# Altium project SensorFusion_V1.2.PrjPcb
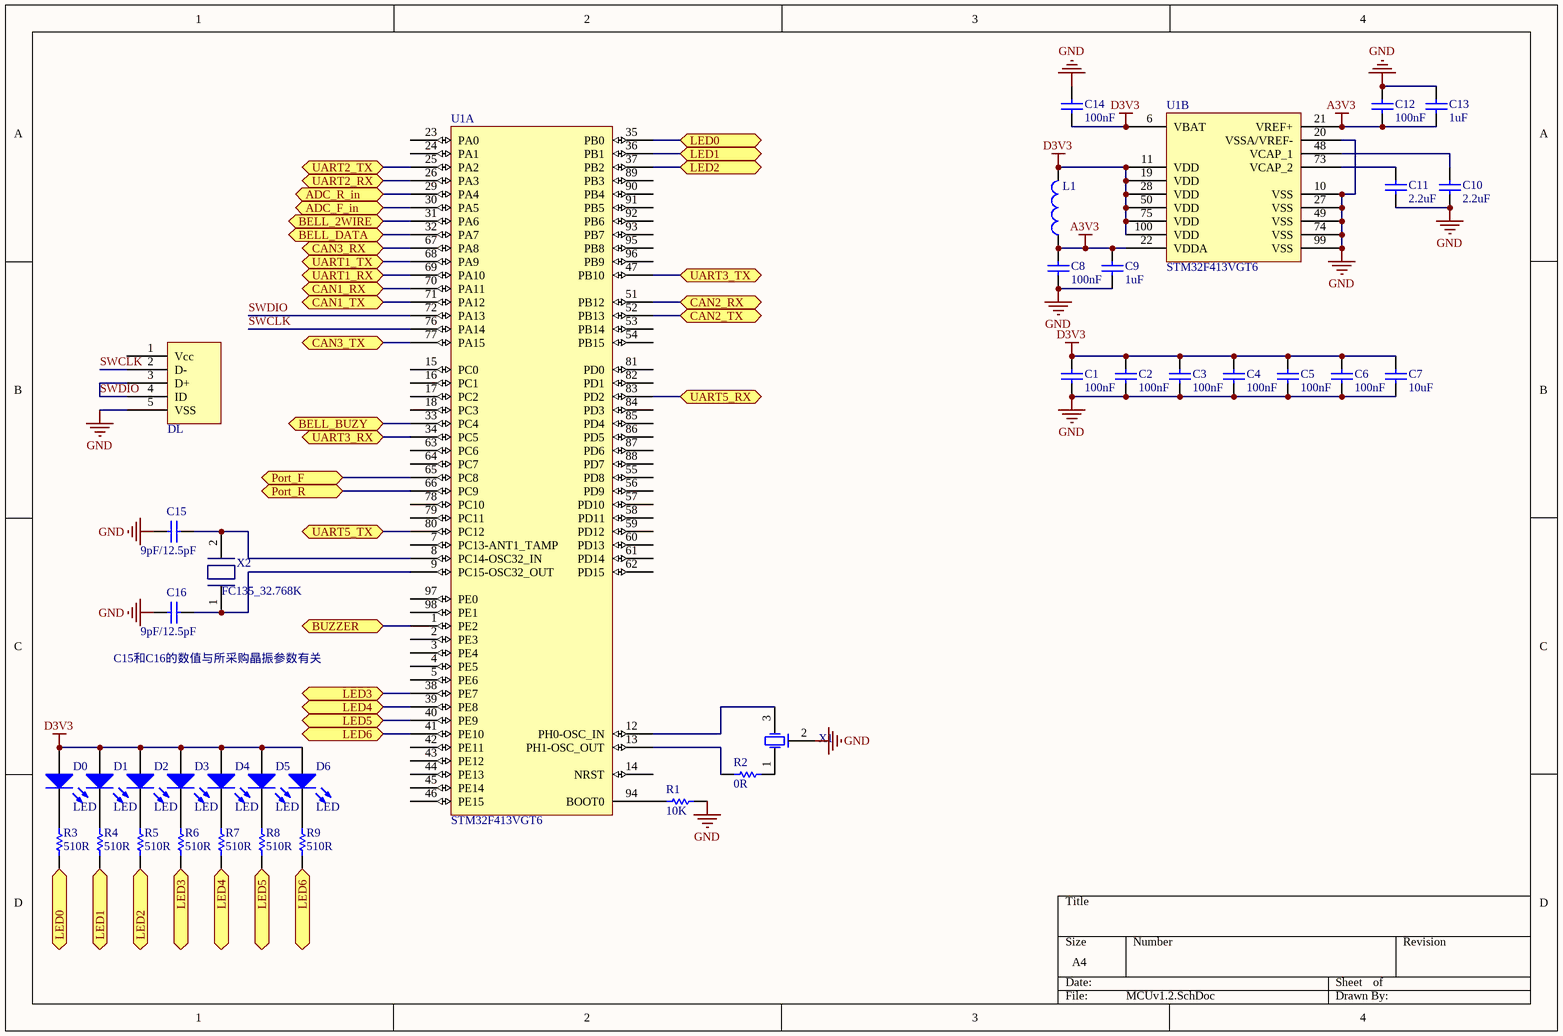
[diagram p0: MCUv1.2.SchDoc]
4 sheets, 137 parts. Net scope: flat (ports and power ports of the same name join across sheets).
Board file: SensorFusionV1.2.PcbDoc
Sheets:
  MCUv1.2.SchDoc
  InterfaceV1.2.SchDoc
  PowerV1.2.SchDoc
  AEBS component_FrontV1.2.SchDoc

## Sheet MCUv1.2.SchDoc
size A4

### Parts
C1  100nF  [0402]
C2  100nF  [0402]
C3  100nF  [0402]
C4  100nF  [0402]
C5  100nF  [0402]
C6  100nF  [0402]
C7  10uF  [0805]
C8  100nF  [0402]
C9  1uF  [0402]
C10  2.2uF  [0603]
C11  2.2uF  [0603]
C12  100nF  [0402]
C13  1uF  [0402]
C14  100nF  [0402]
C15  9pF/12.5pF  [0402]
C16  9pF/12.5pF  [0402]
D0  LED  [1206]
D1  LED  [1206]
D2  LED  [1206]
D3  LED  [1206]
D4  LED  [1206]
D5  LED  [1206]
D6  LED  [1206]
DL  USB_5pin  [USBmicro_B]  (value not drawn)
L1  BLM15BD221SN1D  [0402]  (value not drawn)
R1  10K  [0402]
R2  0R  [0402]
R3  510R  [0402]
R4  510R  [0402]
R5  510R  [0402]
R6  510R  [0402]
R7  510R  [0402]
R8  510R  [0402]
R9  510R  [0402]
U1  STM32F413VGT6  [STM-LQFP100_V]  (parts A,B of 2)
X1  8M smd  [8Mhz_XTAL]  (value not drawn)
X2  FC135_32.768K  [FC135]

### Ports
ADC_F_in (bidir), ADC_R_in (bidir), BELL_2WIRE, BELL_BUZY, BELL_DATA, BUZZER, CAN1_RX, CAN1_TX, CAN2_RX, CAN2_TX, CAN3_RX, CAN3_TX, LED0, LED1, LED2, LED3, LED4, LED5, LED6, Port_F (bidir), Port_R (bidir), UART1_RX, UART1_TX, UART2_RX, UART2_TX, UART3_RX, UART3_TX, UART5_RX, UART5_TX

### Nets
A3V3: C8.2 C9.2 C12.1 C13.1 L1.1 U1.21(VREF+) U1.22(VDDA)
D3V3: C1.2 C2.2 C3.2 C4.2 C5.2 C6.2 C7.2 C14.1 D0.1(A) D1.1(A) D2.1(A) D3.1(A) D4.1(A) D5.1(A) D6.1(A) L1.2 U1.6(VBAT) U1.11(VDD) U1.19(VDD) U1.28(VDD) U1.50(VDD) U1.75(VDD) U1.100(VDD)
GND: C1.1 C2.1 C3.1 C4.1 C5.1 C6.1 C7.1 C8.1 C9.1 C10.1 C11.1 C12.2 C13.2 C14.2 C15.2 C16.2 DL.5(VSS) R1.2 U1.10(VSS) U1.20(VSSA/VREF-) U1.27(VSS) U1.49(VSS) U1.74(VSS) U1.99(VSS) X1.2(GND)
SWCLK: DL.2(D-) U1.76(PA14)
SWDIO: DL.3(D+) DL.4(ID) U1.72(PA13)
NetC10_2: C10.2 U1.48(VCAP_1)
NetC11_2: C11.2 U1.73(VCAP_2)
NetC15_1: C15.1 U1.8(PC14-OSC32_IN) X2.2
NetC16_1: C16.1 U1.9(PC15-OSC32_OUT) X2.1
NetC28_2: U1.30(PA5) ; port ADC_F_in
NetC47_2: U1.29(PA4) ; port ADC_R_in
NetD0_2: D0.2(K) R3.2
NetD1_2: D1.2(K) R4.2
NetD2_2: D2.2(K) R5.2
NetD3_2: D3.2(K) R6.2
NetD4_2: D4.2(K) R7.2
NetD5_2: D5.2(K) R8.2
NetD6_2: D6.2(K) R9.2
NetP1_6: U1.47(PB10) ; port UART3_TX
NetP1_19: U1.34(PC5) ; port UART3_RX
NetQ1_2: U1.1(PE2) ; port BUZZER
NetR1_1: R1.1 U1.94(BOOT0)
NetR2_1: R2.1 X1.1(OSC1)
NetR2_2: R2.2 U1.13(PH1-OSC_OUT)
NetR3_1: R3.1 U1.35(PB0) ; port LED0
NetR4_1: R4.1 U1.36(PB1) ; port LED1
NetR5_1: R5.1 U1.37(PB2) ; port LED2
NetR6_1: R6.1 U1.38(PE7) ; port LED3
NetR7_1: R7.1 U1.39(PE8) ; port LED4
NetR8_1: R8.1 U1.40(PE9) ; port LED5
NetR9_1: R9.1 U1.41(PE10) ; port LED6
NetR22_1: U1.65(PC8) ; port Port_F
NetR30_1: U1.66(PC9) ; port Port_R
NetU1_12: U1.12(PH0-OSC_IN) X1.3(OSC2)
NetU1_25: U1.25(PA2) ; port UART2_TX
NetU1_26: U1.26(PA3) ; port UART2_RX
NetU1_31: U1.31(PA6) ; port BELL_2WIRE
NetU1_32: U1.32(PA7) ; port BELL_DATA
NetU1_33: U1.33(PC4) ; port BELL_BUZY
NetU1_51: U1.51(PB12) ; port CAN2_RX
NetU1_52: U1.52(PB13) ; port CAN2_TX
NetU1_67: U1.67(PA8) ; port CAN3_RX
NetU1_68: U1.68(PA9) ; port UART1_TX
NetU1_69: U1.69(PA10) ; port UART1_RX
NetU1_70: U1.70(PA11) ; port CAN1_RX
NetU1_71: U1.71(PA12) ; port CAN1_TX
NetU1_77: U1.77(PA15) ; port CAN3_TX
NetU1_80: U1.80(PC12) ; port UART5_TX
NetU1_83: U1.83(PD2) ; port UART5_RX

Not connected (* = marked no-connect by the designer): DL 1(Vcc); U1 2(PE3) 3(PE4) 4(PE5) 5(PE6) 7(PC13-ANT1_TAMP) 14(NRST) 15(PC0) 16(PC1) 17(PC2) 18(PC3) 23(PA0) 24(PA1) 42(PE11) 43(PE12) 44(PE13) 45(PE14) 46(PE15) 53(PB14) 54(PB15) 55(PD8) 56(PD9) 57(PD10) 58(PD11) 59(PD12) 60(PD13) 61(PD14) 62(PD15) 63(PC6) 64(PC7) 78(PC10) 79(PC11) 81(PD0) 82(PD1) 84(PD3) 85(PD4) 86(PD5) 87(PD6) 88(PD7) 89(PB3) 90(PB4) 91(PB5) 92(PB6) 93(PB7) 95(PB8) 96(PB9) 97(PE0) 98(PE1)

### Notes on the sheet
- (near C16) C15和C16的数值与所采购晶振参数有关

### Library data of the parts
C1-C6 C8 C12 C14 = Cap: Capacitor; Published: 8-Jun-2000; LatestRevisionDate: 17-Jul-2002; LatestRevisionNote: Re-released for DXP Platform.; PackageReference: RAD-0.3; Publisher: Altium Limited; PackageDescription: Radial Cap, Thru-Hole; 2 Leads; 0.3 in Pin Spacing; Value: 100nF
C7 C9-C11 C13 C15 C16 = Cap: Capacitor; Value: 100nF; Published: 8-Jun-2000; LatestRevisionDate: 17-Jul-2002; LatestRevisionNote: Re-released for DXP Platform.; PackageReference: RAD-0.3; Publisher: Altium Limited; PackageDescription: Radial Cap, Thru-Hole; 2 Leads; 0.3 in Pin Spacing
D0-D6 = LED0: green LED; Published: 8-Jun-2000; LatestRevisionDate: 08-Jul-2005; LatestRevisionNote: Mech Layer 1 removed.; PackageReference: LED-0; Publisher: Altium Limited; PackageDescription: LED; 2 Leads
L1 = Inductor: muRata ferrite bead; Code_IEC: 1005; Value: 10mH; Published: 8-Jun-2000; LatestRevisionDate: 29-May-2009; LatestRevisionNote: IPC-7351 Footprint Added.; PackageReference: 0402-A; Publisher: Altium Limited; PackageDescription: Chip Inductor; Code_JEITA: 0402
R1 R3-R9 = Res1: Resistor; Value: 1K; Published: 8-Jun-2000; LatestRevisionDate: 17-Jul-2002; LatestRevisionNote: Re-released for DXP Platform.; PackageReference: AXIAL-0.3; Publisher: Altium Limited; PackageDescription: Axial Device, Thru-Hole; 2 Leads; 0.3 in Pin Spacing
R2 = Res1: Resistor; Value: 100R; Published: 8-Jun-2000; LatestRevisionDate: 17-Jul-2002; LatestRevisionNote: Re-released for DXP Platform.; PackageReference: AXIAL-0.3; Publisher: Altium Limited; PackageDescription: Axial Device, Thru-Hole; 2 Leads; 0.3 in Pin Spacing
U1 = CMP-1771-00004-1: ARM Cortex-M4 32-Bit DSP+FPU, 1024 KB Flash, 82 I/Os, 100-Pin LQFP, -40 to 85 degC, Tray; ComponentLink1URL: http://www.st.com/; PackageDescription: 100-Pin Low Profile Quad Flat Package, Body 14 x 14 mm, Pitch 0.5 mm; Mounting Technology: Surface Mount; PackageReference: LQFP100; ComponentLink1Description: Manufacturer URL; DatasheetVersion: Rev. 1; PartId: 1
X1 = 8M smd: muRata
X2 = XTAL_32.768k

## Sheet InterfaceV1.2.SchDoc
size A4
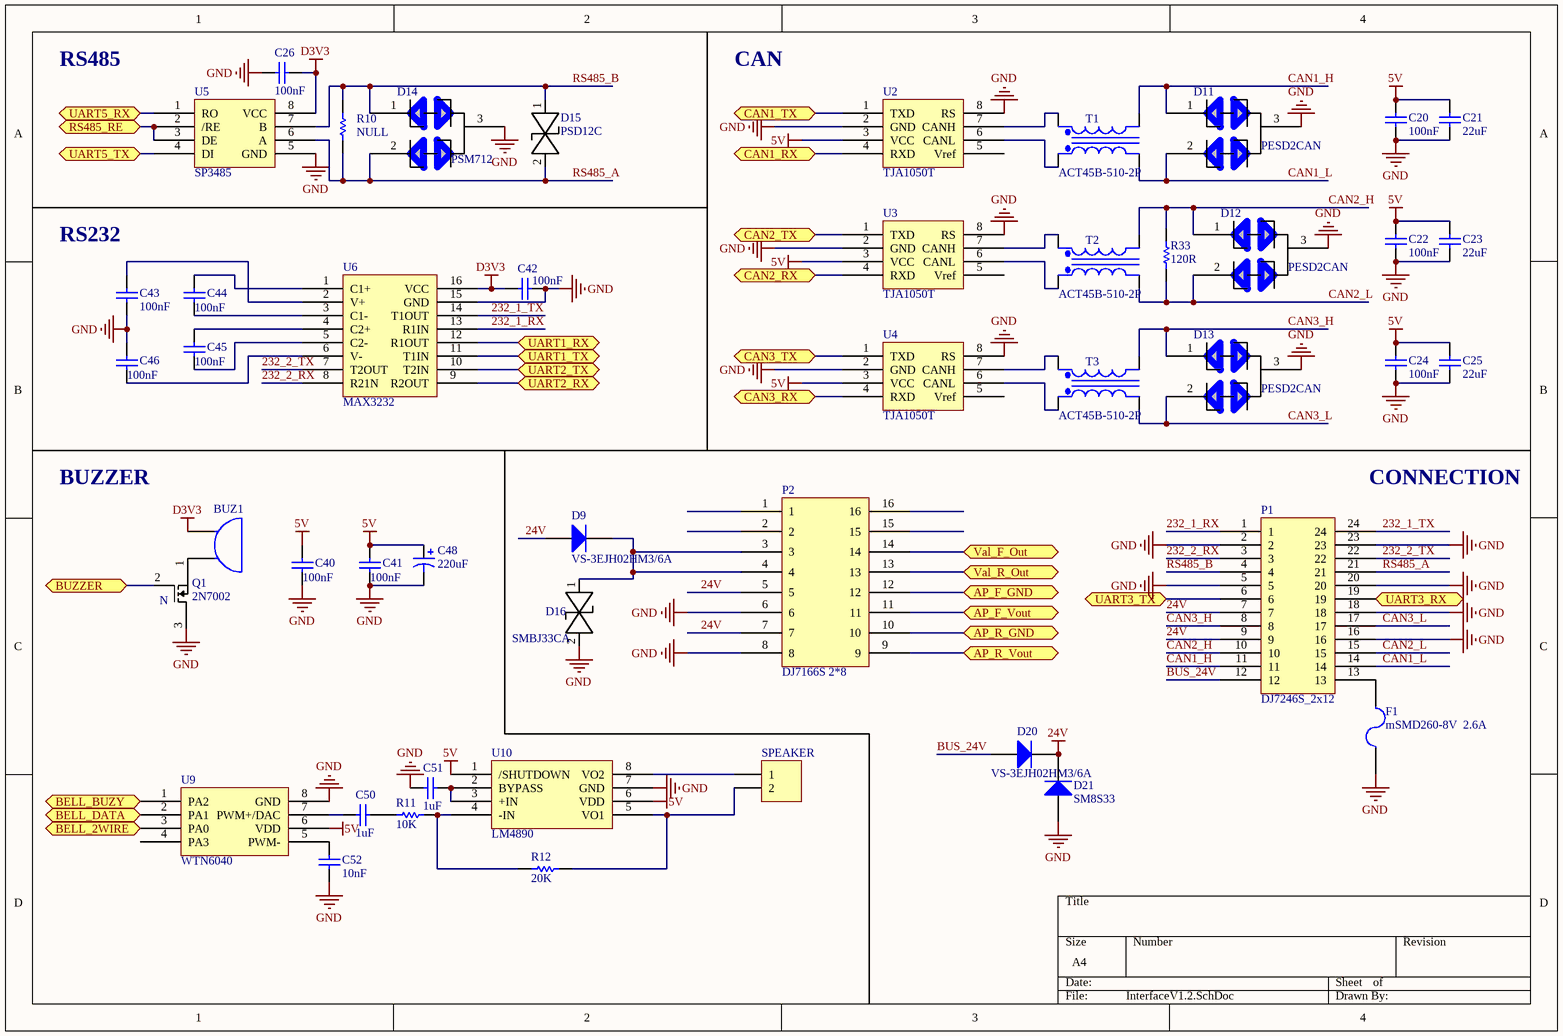
[diagram p1: InterfaceV1.2.SchDoc]

### Parts
BUZ1  BUZZER  [BUZ0905]  (value not drawn)
C20  100nF  [0402]
C21  22uF  [0805]
C22  100nF  [0402]
C23  22uF  [0805]
C24  100nF  [0402]
C25  22uF  [0805]
C26  100nF  [0603]
C40  100nF  [0402]
C41  100nF  [0402]
C42  100nF  [0402]
C43  100nF  [0402]
C44  100nF  [0402]
C45  100nF  [0402]
C46  100nF  [0402]
C48  220uF  [cap_pol_8*10.2]
C50  1uF  [0402]
C51  1uF  [0402]
C52  10nF  [0402]
D9  VS-3EJH02HM3/6A  [B290]
D11  PESD2CAN  [SOT23]
D12  PESD2CAN  [SOT23]
D13  PESD2CAN  [SOT23]
D14  PSM712  [SOT23]
D15  PSD12C  [SOD323]
D16  SMBJ33CA  [SMBJ33CA]
D20  VS-3EJH02HM3/6A  [B290]
D21  SM8S33  [SM8S]
F1  mSMD260-8V  2.6A  [1812]
P1  DJ7246S_2x12  [DJ7246S-0.7-10AW]
P2  DJ7166S 2*8  [DJ7161S_0.7_10AW]
Q1  2N7002  [2N7002]
R10  NULL  [0603]
R11  10K  [0402]
R12  20K  [0402]
R33  120R  [0603]
SPEAKER  XH2.54-2PIN  [HDR1X2]  (value not drawn)
T1  ACT45B-510-2P  [ACT45B-510-2P]
T2  ACT45B-510-2P  [ACT45B-510-2P]
T3  ACT45B-510-2P  [ACT45B-510-2P]
U2  TJA1050T  [SO8]
U3  TJA1050T  [SO8]
U4  TJA1050T  [SO8]
U5  SP3485  [SO-8N]
U6  MAX3232  [SO16]
U9  WTN6040  [SO8]
U10  LM4890  [MSOP8]

### Ports
AP_F_GND (bidir), AP_F_Vout (bidir), AP_R_GND (bidir), AP_R_Vout (bidir), BELL_2WIRE, BELL_BUZY, BELL_DATA, BUZZER, CAN1_RX, CAN1_TX, CAN2_RX, CAN2_TX, CAN3_RX, CAN3_TX, RS485_RE, UART1_RX, UART1_TX, UART2_RX, UART2_TX, UART3_RX, UART3_TX, UART5_RX, UART5_TX, Val_F_Out (bidir), Val_R_Out (bidir)

### Nets
5V: C20.2 C21.2 C22.2 C23.2 C24.2 C25.2 C40.2 C41.2 C48.1 U2.3(VCC) U3.3(VCC) U4.3(VCC) U9.6(VDD) U10.1(/SHUTDOWN) U10.6(VDD)
24V: D9.1(A) D20.2(K) D21.2(K) P1.7 P1.9 P2.5 P2.7
D3V3: BUZ1.1(A) C26.2 C42.2 U5.8(VCC) U6.16(VCC)
GND: C20.1 C21.1 C22.1 C23.1 C24.1 C25.1 C26.1 C40.1 C41.1 C42.1 C43.2 C46.2 C48.2 C51.2 C52.2 D11.3 D12.3 D13.3 D14.3 D16.2 D21.1(A) F1.2 P1.2 P1.5 P1.16 P1.18 P1.20 P1.23 P2.6 P2.8 Q1.3(S) U2.2(GND) U2.8(RS) U3.2(GND) U3.8(RS) U4.2(GND) U4.8(RS) U5.5(GND) U6.15(GND) U9.8(GND) U10.7(GND)
232_1_RX: P1.1 U6.13(R1IN)
232_1_TX: P1.24 U6.14(T1OUT)
232_2_RX: P1.3 U6.8(R21N)
232_2_TX: P1.22 U6.7(T2OUT)
BUS_24V: D20.1(A) P1.12
CAN1_H: D11.1 P1.11 T1.4(Sec-)
CAN1_L: D11.2 P1.14 T1.2(Pri-)
CAN2_H: D12.1 P1.10 R33.2 T2.4(Sec-)
CAN2_L: D12.2 P1.15 R33.1 T2.2(Pri-)
CAN3_H: D13.1 P1.8 T3.4(Sec-)
CAN3_L: D13.2 P1.17 T3.2(Pri-)
RS485_A: D14.2 D15.2 P1.21 R10.2 U5.6(A)
RS485_B: D14.1 D15.1 P1.4 R10.1 U5.7(B)
NetBUZ1_2: BUZ1.2(B) Q1.1(D)
NetC43_1: C43.1 U6.2(V+)
NetC44_1: C44.1 U6.3(C1-)
NetC44_2: C44.2 U6.1(C1+)
NetC45_1: C45.1 U6.5(C2-)
NetC45_2: C45.2 U6.4(C2+)
NetC46_1: C46.1 U6.6(V-)
NetC50_1: C50.1 R11.1
NetC50_2: C50.2 U9.7(PWM+/DAC)
NetC51_1: C51.1 U10.2(BYPASS) U10.3(+IN)
NetC52_1: C52.1 U9.5(PWM-)
NetD9_2: D9.2(K) D16.1 P2.3 P2.4
NetF1_1: F1.1 P1.13
NetF2_1: P2.12 ; port AP_F_GND
NetF3_2: P2.14 ; port Val_F_Out
NetF4_1: P2.10 ; port AP_R_GND
NetF5_2: P2.13 ; port Val_R_Out
NetP1_6: P1.6 ; port UART3_TX
NetP1_19: P1.19 ; port UART3_RX
NetP2_9: P2.9 ; port AP_R_Vout
NetP2_11: P2.11 ; port AP_F_Vout
NetQ1_2: Q1.2(G) ; port BUZZER
NetR11_2: R11.2 R12.1 U10.4(-IN)
NetR12_2: R12.2 SPEAKER.2 U10.5(VO1)
NetSPEAKER_1: SPEAKER.1 U10.8(VO2)
NetT1_1: T1.1(Pri+) U2.6(CANL)
NetT1_3: T1.3(Sec+) U2.7(CANH)
NetT2_1: T2.1(Pri+) U3.6(CANL)
NetT2_3: T2.3(Sec+) U3.7(CANH)
NetT3_1: T3.1(Pri+) U4.6(CANL)
NetT3_3: T3.3(Sec+) U4.7(CANH)
NetU1_25: U6.10(T2IN) ; port UART2_TX
NetU1_26: U6.9(R2OUT) ; port UART2_RX
NetU1_31: U9.3(PA0) ; port BELL_2WIRE
NetU1_32: U9.2(PA1) ; port BELL_DATA
NetU1_33: U9.1(PA2) ; port BELL_BUZY
NetU1_51: U3.4(RXD) ; port CAN2_RX
NetU1_52: U3.1(TXD) ; port CAN2_TX
NetU1_67: U4.4(RXD) ; port CAN3_RX
NetU1_68: U6.11(T1IN) ; port UART1_TX
NetU1_69: U6.12(R1OUT) ; port UART1_RX
NetU1_70: U2.4(RXD) ; port CAN1_RX
NetU1_71: U2.1(TXD) ; port CAN1_TX
NetU1_77: U4.1(TXD) ; port CAN3_TX
NetU1_80: U5.4(DI) ; port UART5_TX
NetU1_83: U5.1(RO) ; port UART5_RX
NetU5_2: U5.2(/RE) U5.3(DE) ; port RS485_RE

Not connected (* = marked no-connect by the designer): P2 1 2 15 16; U2 5(Vref); U3 5(Vref); U4 5(Vref); U9 4(PA3)

### Notes on the sheet
- RS485
- CAN
- (near C43) RS232
- BUZZER
- (near P1) CONNECTION
- (in symbol N-MOSFET) N

### Library data of the parts
C20-C26 C40-C46 = Cap: Capacitor; Published: 8-Jun-2000; Publisher: Altium Limited
  C20 C22 C24 C26 C40-C46: LatestRevisionDate: 17-Jul-2002; LatestRevisionNote: Re-released for DXP Platform.; PackageReference: RAD-0.3; PackageDescription: Radial Cap, Thru-Hole; 2 Leads; 0.3 in Pin Spacing; Value: 100nF
  C21 C23 C25: Revision: July-2002: Re-released for DXP Platform.; Value: 22uF
C48 = Cap Pol1: Polarized Capacitor (Radial); Value: 47uF; Published: 8-Jun-2000; LatestRevisionDate: 17-Jul-2002; LatestRevisionNote: Re-released for DXP Platform.; PackageReference: RB7.6-15; Publisher: Altium Limited; PackageDescription: Polarized Capacitor (Radial); 2 Leads
C50-C52 = Cap: Capacitor; Value: 100nF; Published: 8-Jun-2000; LatestRevisionDate: 17-Jul-2002; LatestRevisionNote: Re-released for DXP Platform.; PackageReference: RAD-0.3; Publisher: Altium Limited; PackageDescription: Radial Cap, Thru-Hole; 2 Leads; 0.3 in Pin Spacing
D9 = Diode: Default Diode; Published: 8-Jun-2000; LatestRevisionDate: 17-Jul-2002; LatestRevisionNote: Re-released for DXP Platform.; PackageVersion: Sep-1996; PackageReference: SMC; Publisher: Altium Limited; PackageDescription: DO-214-AB/SMC; 2 C-Bend Leads; Body 7.9 x 5.9 mm, inc. leads (LxW); Code_JEDEC: DO-214-AB
D11-D14 = PESD1CAN
D16 = PSD12C
D20 = Diode 1N4007: 1 Amp General Purpose Rectifier; pin to pad: 1>2 2>1; Published: 8-Jun-2000; LatestRevisionDate: 17-Jul-2002; LatestRevisionNote: Re-released for DXP Platform.; DatasheetVersion: 1998; PackageVersion: Aug-1999; PackageReference: DO-41; Publisher: Altium Limited; PackageDescription: Diode, Axial; Body 5.2 x 2.7 mm (LxDia. max), Lead Dia. 0.86 mm (max); Code_JEDEC: DO-204-AL; ComponentLink1Description: Manufacturer Link; ComponentLink1URL: http://www.fairchildsemi.com/; ComponentLink2Description: Datasheet; ComponentLink2URL: http://www.fairchildsemi.com/ds/1N%2F1N4001.pdf
D21 = Diode 1N4007: 1 Amp General Purpose Rectifier; Published: 8-Jun-2000; LatestRevisionDate: 17-Jul-2002; LatestRevisionNote: Re-released for DXP Platform.; DatasheetVersion: 1998; PackageVersion: Aug-1999; PackageReference: DO-41; Publisher: Altium Limited; PackageDescription: Diode, Axial; Body 5.2 x 2.7 mm (LxDia. max), Lead Dia. 0.86 mm (max); Code_JEDEC: DO-204-AL; ComponentLink1Description: Manufacturer Link; ComponentLink1URL: http://www.fairchildsemi.com/; ComponentLink2Description: Datasheet; ComponentLink2URL: http://www.fairchildsemi.com/ds/1N%2F1N4001.pdf
F1 = Fuse 2: Fuse; Published: 8-Jun-2000; LatestRevisionDate: 17-Jul-2002; LatestRevisionNote: Re-released for DXP Platform.; PackageReference: PIN-W2/E2.8; Publisher: Altium Limited; PackageDescription: Thru-Hole; 2 Leads
P1 = DJ7246S-0.7-10AW
P2 = DJ7166S
Q1 = N-MOSFET
R10 R11 R33 = Res1: Resistor; Published: 8-Jun-2000; LatestRevisionDate: 17-Jul-2002; LatestRevisionNote: Re-released for DXP Platform.; PackageReference: AXIAL-0.3; Publisher: Altium Limited
  R11: PackageDescription: Axial Device, Thru-Hole; 2 Leads; 0.3 in Pin Spacing; Value: 10K
  R33: PackageDescription: Axial Device, Thru-Hole; 2 Leads; 0.3 in Pin Spacing; Value: 120R
R12 = Res1: Resistor; Value: 10K; Published: 8-Jun-2000; LatestRevisionDate: 17-Jul-2002; LatestRevisionNote: Re-released for DXP Platform.; PackageReference: AXIAL-0.3; Publisher: Altium Limited; PackageDescription: Axial Device, Thru-Hole; 2 Leads; 0.3 in Pin Spacing
SPEAKER = Header 2: Header, 2-Pin; LatestRevisionDate: 17-Jul-2002; LatestRevisionNote: Re-released for DXP Platform.; Publisher: Altium Limited
T1-T3 = Trans Eq: Transformer (Equivalent Circuit Model); Published: 8-Jun-2000; LatestRevisionDate: 17-Jul-2002; LatestRevisionNote: Re-released for DXP Platform.; PackageReference: TRF_4; Publisher: Altium Limited; PackageDescription: Transformer; 4 Leads
U2-U4 = TJA1050T: CAN Tranceiver

## Sheet PowerV1.2.SchDoc
size A4
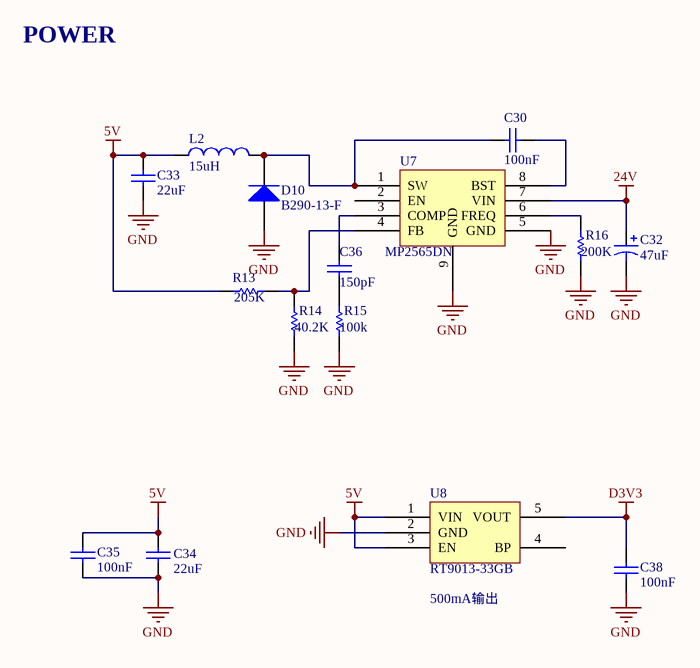
[diagram p2: PowerV1.2.SchDoc]

### Parts
C30  100nF  [0402]
C32  47uF  [cap_pol_8*10.2]
C33  22uF  [0805]
C34  22uF  [1206]
C35  100nF  [0402]
C36  150pF  [0402]
C38  100nF  [0402]
D10  B290-13-F  [B290]
L2  15uH  [10*10Inductor]
R13  205K  [0402]
R14  40.2K  [0402]
R15  100k  [0402]
R16  200K  [0402]
U7  MP2565DN  [MP2565DN]
U8  RT9013-33GB  [SOT-23-5]

### Nets
5V: C33.2 C34.2 C35.2 L2.1 R13.2 U8.1(VIN) U8.3(EN)
24V: C32.1 U7.7(VIN)
D3V3: C38.2 U8.5(VOUT)
GND: C32.2 C33.1 C34.1 C35.1 C38.1 D10.1(A) R14.1 R15.1 R16.1 U7.5(GND) U7.9(GND) U8.2(GND)
NetC30_1: C30.1 U7.8(BST)
NetC30_2: C30.2 D10.2(K) L2.2 U7.1(SW)
NetC36_1: C36.1 U7.3(COMP)
NetC36_2: C36.2 R15.2
NetR13_1: R13.1 R14.2 U7.4(FB)
NetR16_2: R16.2 U7.6(FREQ)

Not connected (* = marked no-connect by the designer): U7 2(EN); U8 4(BP)

### Notes on the sheet
- POWER
- (near U8) 500mA输出

### Library data of the parts
C30 C36 = Cap: Capacitor; Value: 100pF; Published: 8-Jun-2000; LatestRevisionDate: 17-Jul-2002; LatestRevisionNote: Re-released for DXP Platform.; PackageReference: RAD-0.3; Publisher: Altium Limited; PackageDescription: Radial Cap, Thru-Hole; 2 Leads; 0.3 in Pin Spacing
C32 = Cap Pol1: Polarized Capacitor (Radial); Value: 100pF; Published: 8-Jun-2000; LatestRevisionDate: 17-Jul-2002; LatestRevisionNote: Re-released for DXP Platform.; PackageReference: RB7.6-15; Publisher: Altium Limited; PackageDescription: Polarized Capacitor (Radial); 2 Leads
C33 = Cap: Capacitor,50V; Value: 100pF; Published: 8-Jun-2000; LatestRevisionDate: 17-Jul-2002; LatestRevisionNote: Re-released for DXP Platform.; PackageReference: RAD-0.3; Publisher: Altium Limited; PackageDescription: Radial Cap, Thru-Hole; 2 Leads; 0.3 in Pin Spacing
C34 = Cap: Capacitor; Published: 8-Jun-2000; LatestRevisionDate: 17-Jul-2002; LatestRevisionNote: Re-released for DXP Platform.; PackageReference: RAD-0.3; Publisher: Altium Limited; PackageDescription: Radial Cap, Thru-Hole; 2 Leads; 0.3 in Pin Spacing; Value: 22uF
C35 = Cap: Capacitor,100V; Published: 8-Jun-2000; LatestRevisionDate: 17-Jul-2002; LatestRevisionNote: Re-released for DXP Platform.; PackageReference: RAD-0.3; Publisher: Altium Limited; PackageDescription: Radial Cap, Thru-Hole; 2 Leads; 0.3 in Pin Spacing; Value: 100nF
C38 = Cap: Capacitor 3V3; Value: 100pF; Published: 8-Jun-2000; LatestRevisionDate: 17-Jul-2002; LatestRevisionNote: Re-released for DXP Platform.; PackageReference: RAD-0.3; Publisher: Altium Limited; PackageDescription: Radial Cap, Thru-Hole; 2 Leads; 0.3 in Pin Spacing
D10 = Diode: Default Diode; Published: 8-Jun-2000; LatestRevisionDate: 17-Jul-2002; LatestRevisionNote: Re-released for DXP Platform.; PackageVersion: Sep-1996; PackageReference: SMC; Publisher: Altium Limited; PackageDescription: DO-214-AB/SMC; 2 C-Bend Leads; Body 7.9 x 5.9 mm, inc. leads (LxW); Code_JEDEC: DO-214-AB
L2 = Inductor: Inductor, 1A; Code_IEC: 1005; Published: 8-Jun-2000; LatestRevisionDate: 29-May-2009; LatestRevisionNote: IPC-7351 Footprint Added.; PackageReference: 0402-A; Publisher: Altium Limited; PackageDescription: Chip Inductor; Code_JEITA: 0402; Value: 15uH
R13 = Res1: Resistor; Value: 210K; Published: 8-Jun-2000; LatestRevisionDate: 17-Jul-2002; LatestRevisionNote: Re-released for DXP Platform.; PackageReference: AXIAL-0.3; Publisher: Altium Limited
R14 R16 = Res1: Resistor; Published: 8-Jun-2000; LatestRevisionDate: 17-Jul-2002; LatestRevisionNote: Re-released for DXP Platform.; PackageReference: AXIAL-0.3; Publisher: Altium Limited
  R14: Value: 40.2K
  R16: Value: 200K
R15 = Res1: Resistor; Value: 47.5K; Published: 8-Jun-2000; LatestRevisionDate: 17-Jul-2002; LatestRevisionNote: Re-released for DXP Platform.; PackageReference: AXIAL-0.3; Publisher: Altium Limited
U8 = RT9193

## Sheet AEBS component_FrontV1.2.SchDoc
size A4
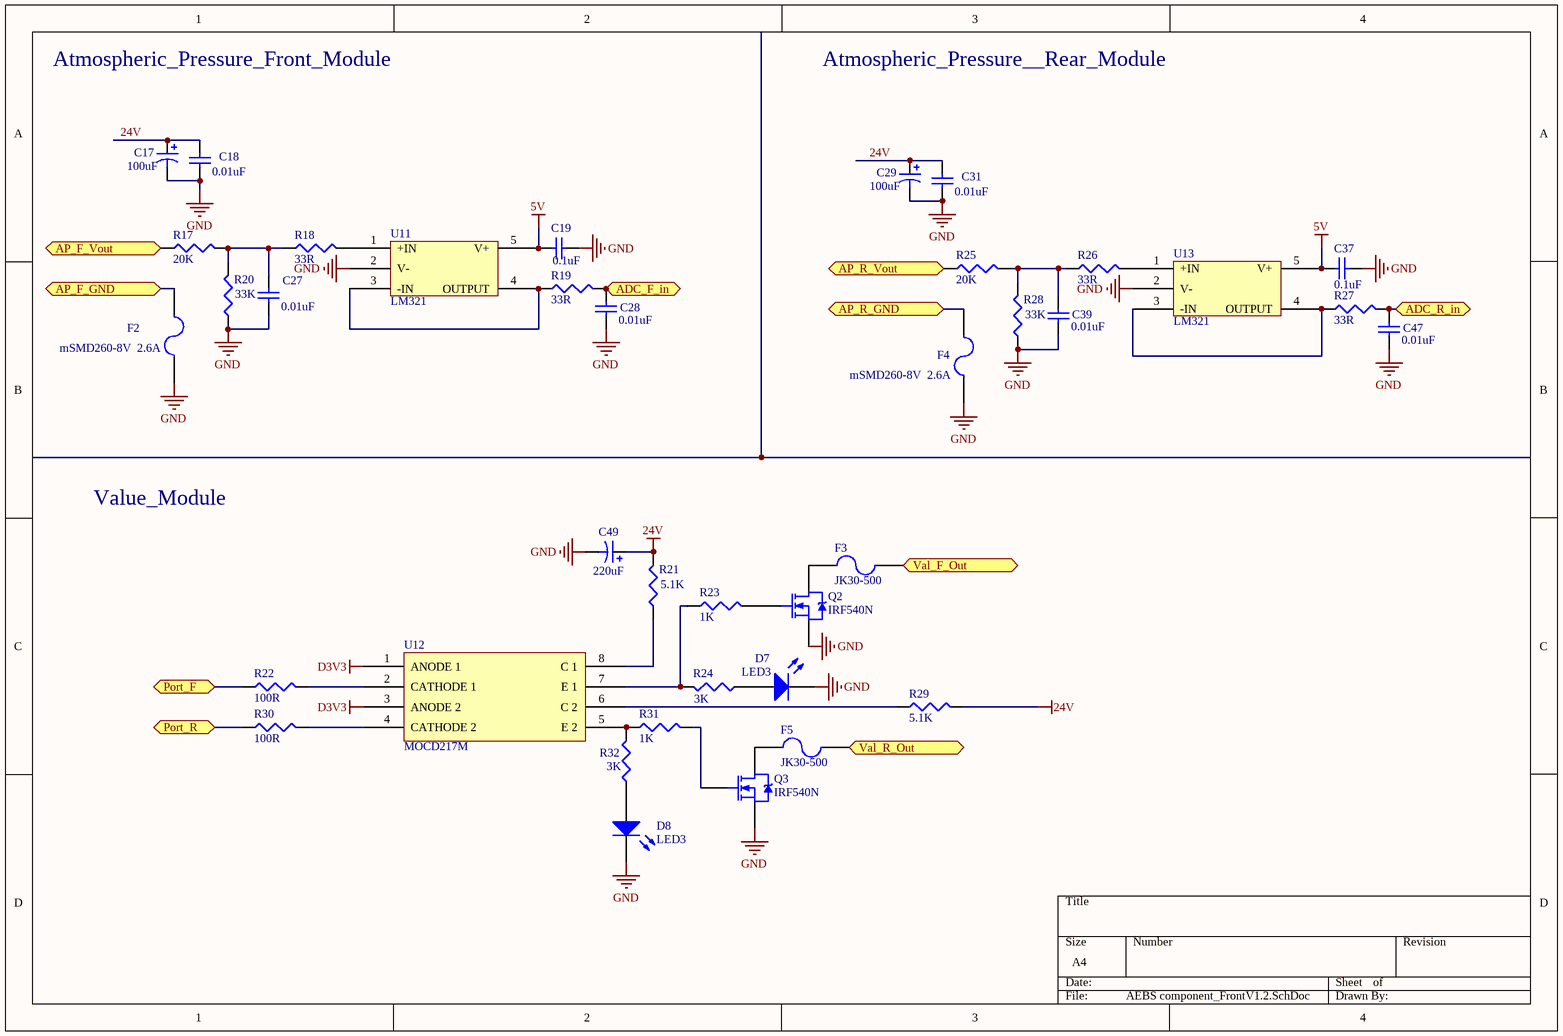
[diagram p3: AEBS component_FrontV1.2.SchDoc]

### Parts
C17  100uF  [CAP_POL_10*10.5]
C18  0.01uF  [0805]
C19  0.1uF  [1608[0603]]
C27  0.01uF  [1608[0603]]
C28  0.01uF  [1608[0603]]
C29  100uF  [CAP_POL_10*10.5]
C31  0.01uF  [0805]
C37  0.1uF  [1608[0603]]
C39  0.01uF  [1608[0603]]
C47  0.01uF  [1608[0603]]
C49  220uF  [CAP_POL_12.5*13.5]
D7  LED3  [1206]
D8  LED3  [1206]
F2  mSMD260-8V  2.6A  [1812]
F3  JK30-500  [JK30-500]
F4  mSMD260-8V  2.6A  [1812]
F5  JK30-500  [JK30-500]
Q2  IRF540N  [TO-220AB]
Q3  IRF540N  [TO-220AB]
R17  20K  [J1-0603]
R18  33R  [J1-0603]
R19  33R  [J1-0603]
R20  33K  [J1-0603]
R21  5.1K  [J1-0603]
R22  100R  [J1-0603]
R23  1K  [J1-0603]
R24  3K  [J1-0603]
R25  20K  [J1-0603]
R26  33R  [J1-0603]
R27  33R  [J1-0603]
R28  33K  [J1-0603]
R29  5.1K  [J1-0603]
R30  100R  [J1-0603]
R31  1K  [J1-0603]
R32  3K  [J1-0603]
U11  LM321  [LM321]
U12  MOCD217M  [MOCD217M]
U13  LM321  [LM321]

### Ports
ADC_F_in (bidir), ADC_R_in (bidir), AP_F_GND (bidir), AP_F_Vout (bidir), AP_R_GND (bidir), AP_R_Vout (bidir), Port_F (bidir), Port_R (bidir), Val_F_Out (bidir), Val_R_Out (bidir)

### Nets
5V: C19.2 C37.2 U11.5(V+) U13.5(V+)
24V: C17.1 C18.1 C29.1 C31.1 C49.1 R21.2 R29.2
D3V3: U12.1(ANODE_1) U12.3(ANODE_2)
GND: C17.2 C18.2 C19.1 C27.1 C28.1 C29.2 C31.2 C37.1 C39.1 C47.1 C49.2 D7.2(K) D8.2(K) F2.2 F4.2 Q2.3(S) Q3.3(S) R20.1 R28.1 U11.2(V-) U13.2(V-)
NetC27_2: C27.2 R17.2 R18.1 R20.2
NetC28_2: C28.2 R19.2 ; port ADC_F_in
NetC39_2: C39.2 R25.2 R26.1 R28.2
NetC47_2: C47.2 R27.2 ; port ADC_R_in
NetD7_1: D7.1(A) R24.1
NetD8_1: D8.1(A) R32.1
NetF2_1: F2.1 ; port AP_F_GND
NetF3_1: F3.1 Q2.2(D)
NetF3_2: F3.2 ; port Val_F_Out
NetF4_1: F4.1 ; port AP_R_GND
NetF5_1: F5.1 Q3.2(D)
NetF5_2: F5.2 ; port Val_R_Out
NetP2_9: R25.1 ; port AP_R_Vout
NetP2_11: R17.1 ; port AP_F_Vout
NetQ2_1: Q2.1(G) R23.2
NetQ3_1: Q3.1(G) R31.2
NetR18_2: R18.2 U11.1(+IN)
NetR19_1: R19.1 U11.3(-IN) U11.4(OUTPUT)
NetR21_1: R21.1 U12.8(C_1)
NetR22_1: R22.1 ; port Port_F
NetR22_2: R22.2 U12.2(CATHODE_1)
NetR23_1: R23.1 R24.2 U12.7(E_1)
NetR26_2: R26.2 U13.1(+IN)
NetR27_1: R27.1 U13.3(-IN) U13.4(OUTPUT)
NetR29_1: R29.1 U12.6(C_2)
NetR30_1: R30.1 ; port Port_R
NetR30_2: R30.2 U12.4(CATHODE_2)
NetR31_1: R31.1 R32.2 U12.5(E_2)

### Notes on the sheet
- Atmospheric_Pressure_Front_Module
- Atmospheric_Pressure__Rear_Module
- Value_Module

### Library data of the parts
C17 C29 = Cap Pol3: Polarized Capacitor (Surface Mount); Published: 8-Jun-2000; LatestRevisionDate: 29-May-2009; LatestRevisionNote: IPC-7351 Footprint Added.; PackageReference: C0805; Publisher: Altium Limited; PackageDescription: Chip Capacitor; Value: 100uF
C18 C19 C27 C28 C31 C37 C39 C47 = Cap Semi: Capacitor (Semiconductor SIM Model); Published: 8-Jun-2000; LatestRevisionDate: 29-May-2009; LatestRevisionNote: IPC-7351 Footprint Added.; PackageReference: C1206; Publisher: Altium Limited; PackageDescription: Chip Capacitor
  C18 C27 C28 C31 C39 C47: Value: 0.01uF
  C19 C37: Value: 0.1uF
C49 = Cap Pol1: Polarized Capacitor (Radial); Published: 8-Jun-2000; LatestRevisionDate: 17-Jul-2002; LatestRevisionNote: Re-released for DXP Platform.; PackageReference: RB7.6-15; Publisher: Altium Limited; PackageDescription: Polarized Capacitor (Radial); 2 Leads; Value: 220uF
D7 D8 = LED3: Typical BLUE SiC LED; Published: 8-Jun-2000; LatestRevisionDate: 17-Dec-2003; LatestRevisionNote: PCB Footprint replaced.; DatasheetVersion: 16-Apr-2002; PackageVersion: 16-Apr-2002; PackageReference: 3.5X2.8X1.9; Publisher: Altium Limited; PackageDescription: SM LED; 2 C-Bend Leads; Body 3.5 x 2.8 x 1.9 mm, inc leads (LxWxH typ)
F2-F5 = Fuse 2: Fuse; Published: 8-Jun-2000; LatestRevisionDate: 17-Jul-2002; LatestRevisionNote: Re-released for DXP Platform.; PackageReference: PIN-W2/E2.8; Publisher: Altium Limited; PackageDescription: Thru-Hole; 2 Leads
Q2 Q3 = NMOS-2: N-Channel Power MOSFET; Note: Pin 2 is electrically connected to pin 4.; Published: 8-Jun-2000; LatestRevisionDate: 17-Jul-2002; LatestRevisionNote: Re-released for DXP Platform.; DatasheetVersion: PD-9.814; PackageVersion: Feb-1997; PackageReference: TO-220AB; Publisher: Altium Limited; PackageDescription: TO, Thru-Hole, Vertical, Heatsink Mounted; 3 In-Line Leads; Pitch 2.54 mm; ComponentLink1Description: Manufacturer Link; ComponentLink1URL: http://www.irf.com/
R17-R32 = Res3: Resistor; Published: 8-Jun-2000; LatestRevisionDate: 29-May-2009; LatestRevisionNote: IPC-7351 Footprint Added.; PackageReference: J1-0603; Publisher: Altium Limited; PackageDescription: Chip Resistor
  R17 R25: Value: 20k
  R18 R19 R26 R27: Value: 33R
  R20 R28: Value: 33k
  R21 R29: Value: 5.1K
  R22 R30: Value: 100R
  R23 R31: Value: 1K
  R24 R32: Value: 3K

## Nets that join several sheets
5V: InterfaceV1.2 (15 pins), PowerV1.2 (7 pins), AEBS component_FrontV1.2 (C19.2 C37.2 U11.5 U13.5)
24V: InterfaceV1.2 (7 pins), PowerV1.2 (C32.1 U7.7), AEBS component_FrontV1.2 (7 pins)
D3V3: MCUv1.2 (23 pins), InterfaceV1.2 (5 pins), PowerV1.2 (C38.2 U8.5), AEBS component_FrontV1.2 (U12.1 U12.3)
GND: MCUv1.2 (25 pins), InterfaceV1.2 (41 pins), PowerV1.2 (12 pins), AEBS component_FrontV1.2 (21 pins)
NetC28_2: MCUv1.2 (U1.30), AEBS component_FrontV1.2 (C28.2 R19.2)
NetC47_2: MCUv1.2 (U1.29), AEBS component_FrontV1.2 (C47.2 R27.2)
NetF2_1: InterfaceV1.2 (P2.12), AEBS component_FrontV1.2 (F2.1)
NetF3_2: InterfaceV1.2 (P2.14), AEBS component_FrontV1.2 (F3.2)
NetF4_1: InterfaceV1.2 (P2.10), AEBS component_FrontV1.2 (F4.1)
NetF5_2: InterfaceV1.2 (P2.13), AEBS component_FrontV1.2 (F5.2)
NetP1_6: MCUv1.2 (U1.47), InterfaceV1.2 (P1.6)
NetP1_19: MCUv1.2 (U1.34), InterfaceV1.2 (P1.19)
NetP2_9: InterfaceV1.2 (P2.9), AEBS component_FrontV1.2 (R25.1)
NetP2_11: InterfaceV1.2 (P2.11), AEBS component_FrontV1.2 (R17.1)
NetQ1_2: MCUv1.2 (U1.1), InterfaceV1.2 (Q1.2)
NetR22_1: MCUv1.2 (U1.65), AEBS component_FrontV1.2 (R22.1)
NetR30_1: MCUv1.2 (U1.66), AEBS component_FrontV1.2 (R30.1)
NetU1_25: MCUv1.2 (U1.25), InterfaceV1.2 (U6.10)
NetU1_26: MCUv1.2 (U1.26), InterfaceV1.2 (U6.9)
NetU1_31: MCUv1.2 (U1.31), InterfaceV1.2 (U9.3)
NetU1_32: MCUv1.2 (U1.32), InterfaceV1.2 (U9.2)
NetU1_33: MCUv1.2 (U1.33), InterfaceV1.2 (U9.1)
NetU1_51: MCUv1.2 (U1.51), InterfaceV1.2 (U3.4)
NetU1_52: MCUv1.2 (U1.52), InterfaceV1.2 (U3.1)
NetU1_67: MCUv1.2 (U1.67), InterfaceV1.2 (U4.4)
NetU1_68: MCUv1.2 (U1.68), InterfaceV1.2 (U6.11)
NetU1_69: MCUv1.2 (U1.69), InterfaceV1.2 (U6.12)
NetU1_70: MCUv1.2 (U1.70), InterfaceV1.2 (U2.4)
NetU1_71: MCUv1.2 (U1.71), InterfaceV1.2 (U2.1)
NetU1_77: MCUv1.2 (U1.77), InterfaceV1.2 (U4.1)
NetU1_80: MCUv1.2 (U1.80), InterfaceV1.2 (U5.4)
NetU1_83: MCUv1.2 (U1.83), InterfaceV1.2 (U5.1)